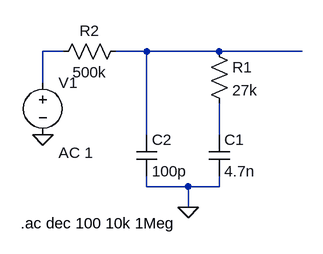
[diagram p0: schematic compensation.asc]
compensation.asc, the LTspice schematic file:
Version 4
SHEET 1 880 680
WIRE -16 0 -48 0
WIRE 112 0 64 0
WIRE 224 0 112 0
WIRE 352 0 224 0
WIRE -48 48 -48 0
WIRE 112 128 112 0
WIRE 224 128 224 80
WIRE 112 208 112 192
WIRE 176 208 112 208
WIRE 224 208 224 192
WIRE 224 208 176 208
WIRE 176 240 176 208
FLAG 176 240 0
FLAG -48 128 0
SYMBOL cap 208 128 R0
SYMATTR InstName C1
SYMATTR Value 4.7n
SYMBOL cap 96 128 R0
SYMATTR InstName C2
SYMATTR Value 100p
SYMBOL res 208 -16 R0
SYMATTR InstName R1
SYMATTR Value 27k
SYMBOL voltage -48 32 R0
WINDOW 123 24 124 Left 2
WINDOW 39 0 0 Left 0
SYMATTR InstName V1
SYMATTR Value ""
SYMATTR Value2 AC 1
SYMBOL res 80 -16 R90
WINDOW 0 0 56 VBottom 2
WINDOW 3 32 56 VTop 2
SYMATTR InstName R2
SYMATTR Value 500k
TEXT -82 264 Left 2 !.ac dec 100 10k 1Meg

The netlist it stands for:
* compensation.asc
C1 N003 0 4.7n
C2 N002 0 100p
R1 N002 N003 27k
V1 N001 0 AC 1
R2 N002 N001 500k
.ac dec 100 10k 1Meg
.backanno
.end